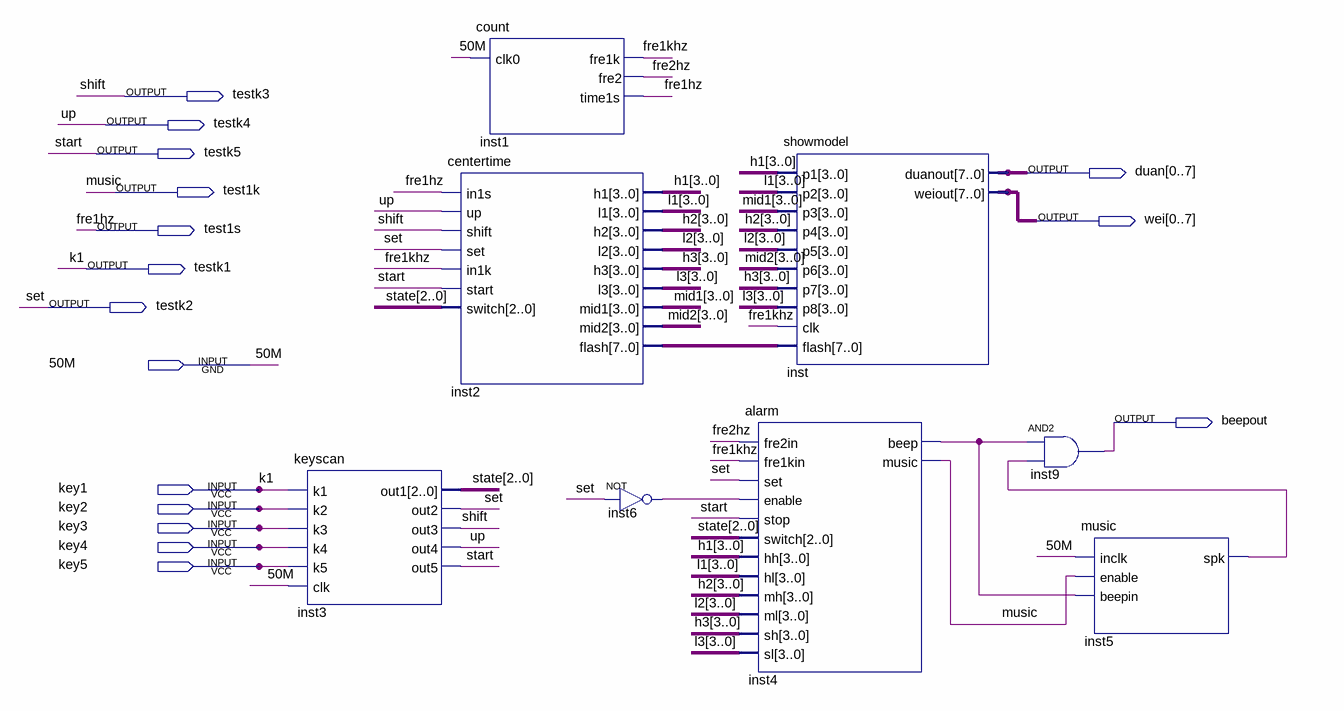
[diagram p0: schematic sheet]
// Quartus schematic clock.bdf as structural Verilog: 8 symbols, 16 pins
module clock (
  input  \50M ,
  input  key1,
  input  key2,
  input  key3,
  input  key4,
  input  key5,
  output testk3,
  output testk4,
  output testk5,
  output [0:7] duan,
  output test1k,
  output [0:7] wei,
  output test1s,
  output testk1,
  output testk2,
  output beepout
);

  wire fre1khz, fre2hz, inst4_beep, inst5_spk, inst6_out;
  wire [2:0] state;
  wire [3:0] h1, h2, h3, l1, l2, l3, mid1, mid2;
  wire [7:0] inst2_flash;

  keyscan inst3 (
    .k1(key1), .k2(key2), .k3(key3), .k4(key4), .k5(key5), .clk(\50M ), .out1(state), .out2(testk2),
    .out3(testk3), .out4(testk4), .out5(testk5));
  centertime inst2 (
    .in1s(test1s), .up(testk4), .shift(testk3), .set(testk2), .in1k(fre1khz), .start(testk5), .switch(state),
    .h1(h1), .l1(l1), .h2(h2), .l2(l2), .h3(h3), .l3(l3), .mid1(mid1), .mid2(mid2), .flash(inst2_flash));
  count inst1 (.clk0(\50M ), .fre1k(fre1khz), .fre2(fre2hz), .time1s(test1s));
  not inst6 (inst6_out, testk2);
  alarm inst4 (
    .fre2in(fre2hz), .fre1kin(fre1khz), .set(testk2), .enable(inst6_out), .stop(testk5), .switch(state),
    .hh(h1), .hl(l1), .mh(h2), .ml(l2), .sh(h3), .sl(l3), .beep(inst4_beep), .music(test1k));
  showmodel inst (
    .p1(h1), .p2(l1), .p3(mid1), .p4(h2), .p5(l2), .p6(mid2), .p7(h3), .p8(l3), .clk(fre1khz),
    .flash(inst2_flash), .duanout(duan), .weiout(wei));
  and inst9 (beepout, inst4_beep, inst5_spk);
  music inst5 (.inclk(\50M ), .enable(test1k), .beepin(inst4_beep), .spk(inst5_spk));

  assign testk1 = key1;

  // Other names for the same wires on the sheet: fre1hz = test1s; k1 = key1; music = test1k; set = testk2;
  //   shift = testk3; start = testk5; up = testk4
endmodule
